# Altium project UNG_8077_EVB_LAN7801-KSZ9031.PrjPcb (part 2 of 2)

## Sheet UNG8077_EVB_7801-9031_A_4-KSZ9031.SchDoc
size 416 x 264 mm; DrawnBy: Carl Johnson; Engineer: Xuelu Li; Revision: A; SheetNumber: 4; SheetTotal: 5; PageTitle: KSZ9031RNX; PageSetup: Record=PageOptions|CenterHorizontal=True|CenterVertical=True|PrintScale=1.02|XCorrection=1.00|YCorrection=1.00|PrintKind=0|BorderSize=5000000|LeftOffset=0|BottomOffset=0|Orientation=2|PaperLength=1000|PaperWidth=1000|Scale=100|PaperSource=7|PrintQuality=-3|MediaType=1|DitherType=10|PrintScaleMode=1|PaperKind=11 x 17|PaperIndex=119; DesignDescription: EVB_LAN7801 to KSZ9031RNX; ProjName: EVB_LAN7801-KSZ9031; Designer: Xuelu Li; PartNumber: UNG_8077; DocumentFullPathAndName: //depot_np_hweng_boards/ung_hweng/UNG_8077_LAN7801-KSZ9031_DemoEVB/A/; ProjectName: UNG_8077_EVB_LAN7801-KSZ9031.PrjPcb
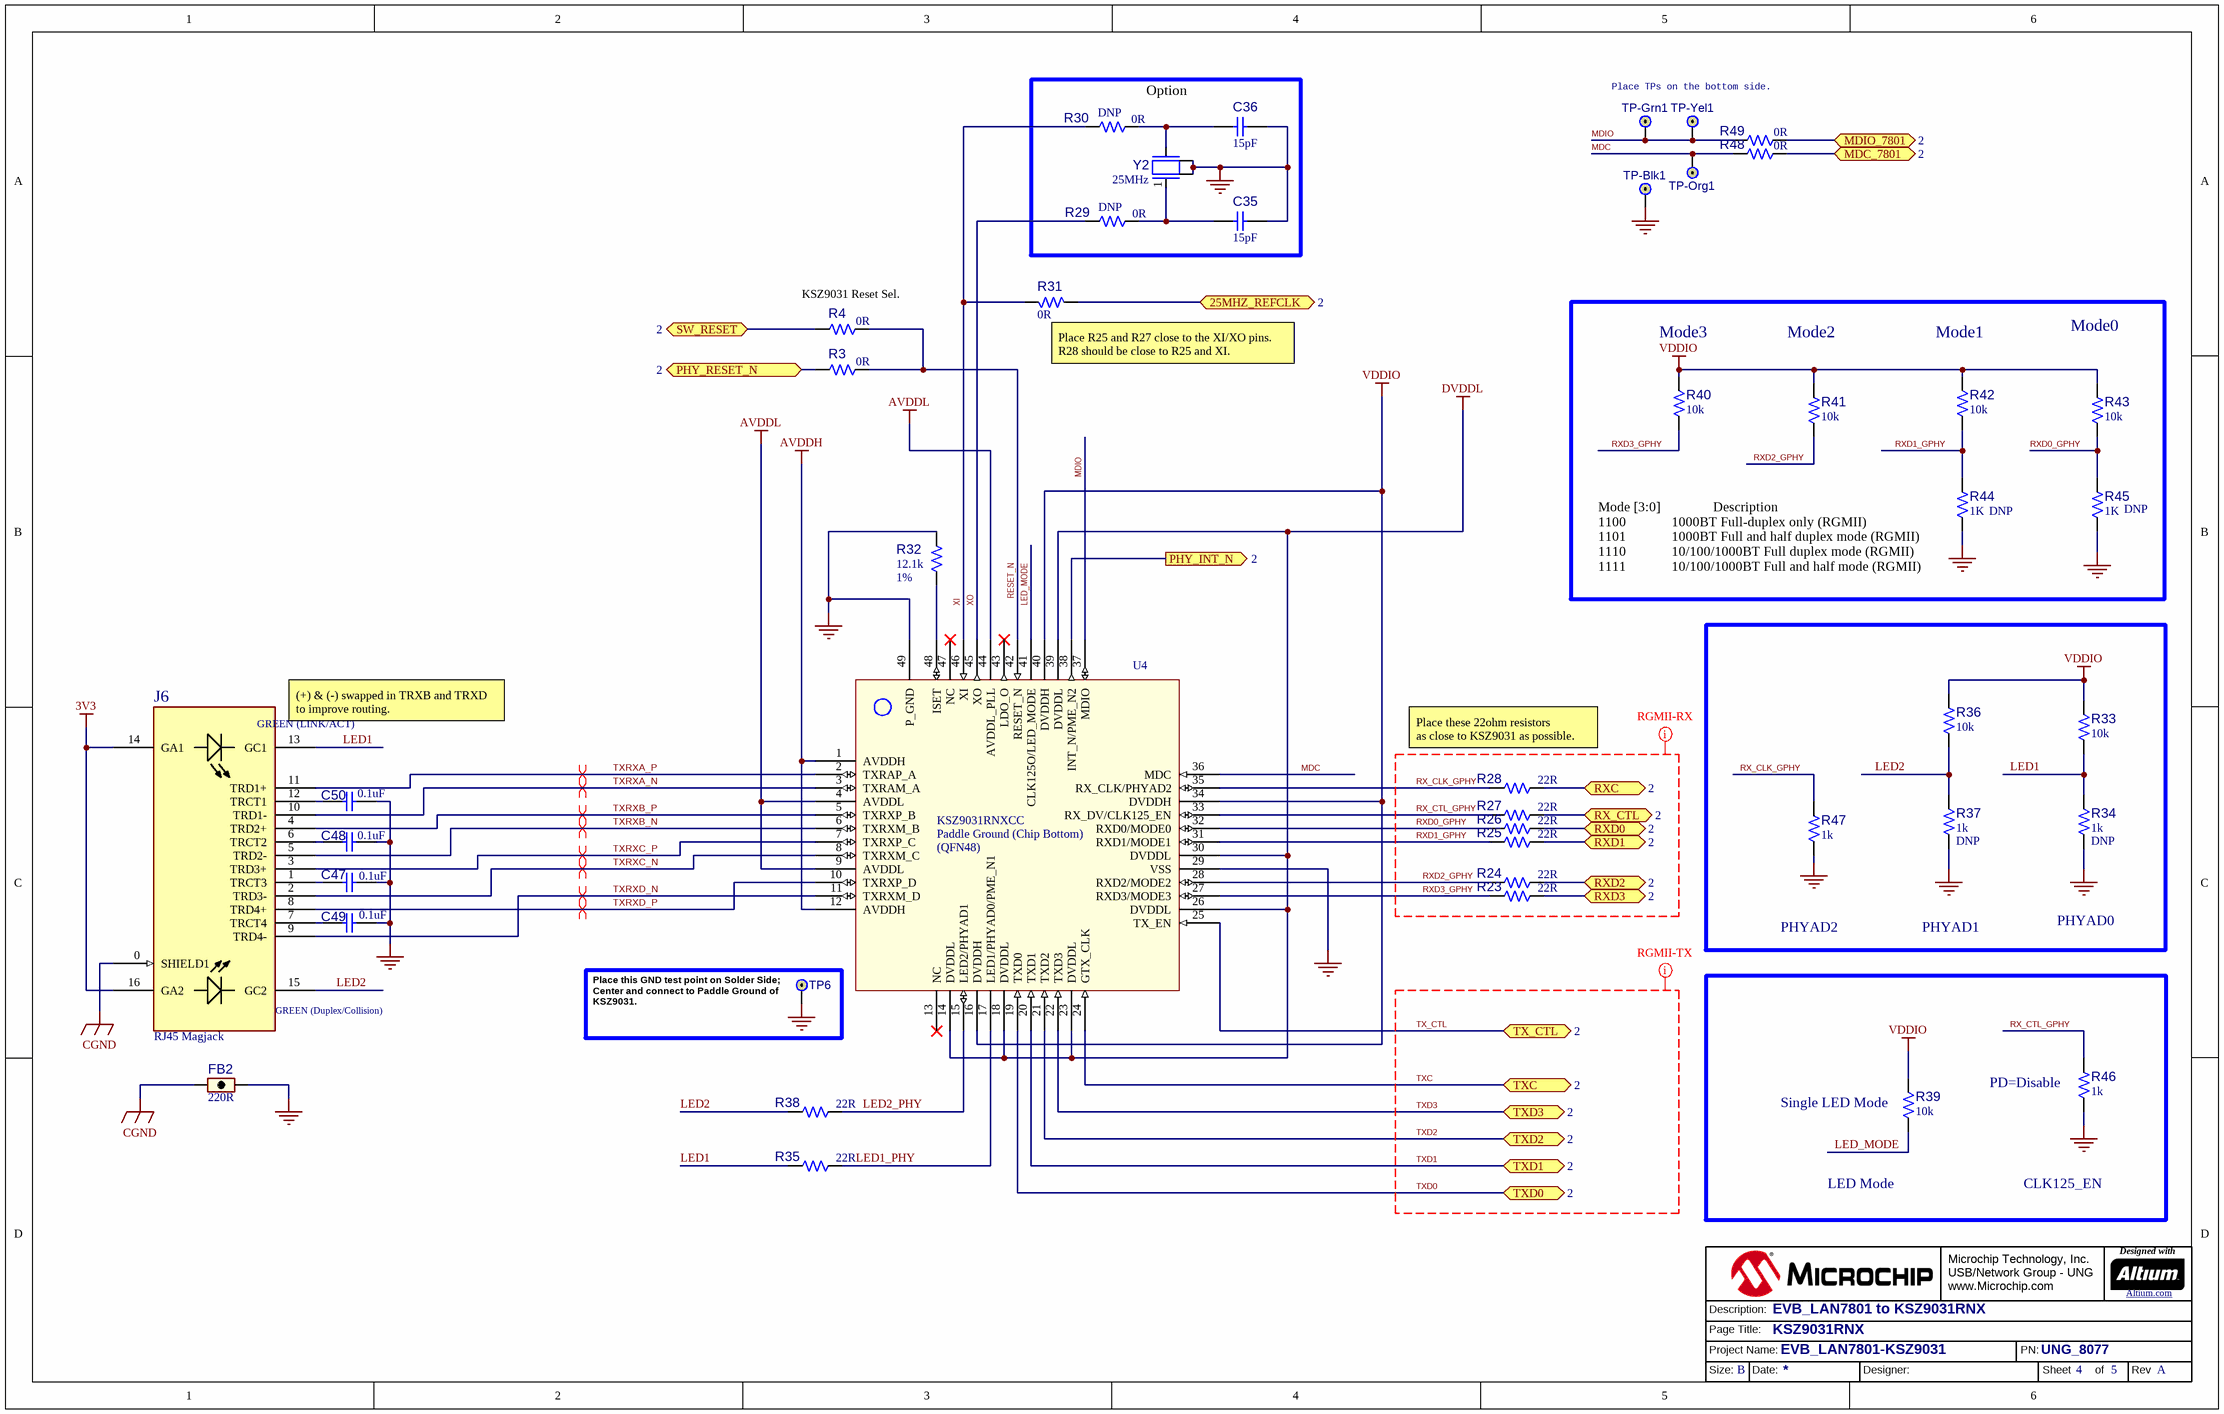
[diagram p3: UNG8077_EVB_7801-9031_A_4-KSZ9031.SchDoc]

### Parts
(Parts that share a designator on the sheet are numbered #1, #2 ... from top to bottom, then left to right.)
?#4  (no value)  (graphical)
C35  value 15pF  [CAP_C_0402]  (hidden comment: Capacitor NP)
C36  value 15pF  [CAP_C_0402]  (hidden comment: Capacitor NP)
C47  value 0.1uF  [CAP_C_0402]  (hidden comment: CAP CER 0.1UF 35V)
C48  value 0.1uF  [CAP_C_0402]  (hidden comment: CAP CER 0.1UF 35V)
C49  value 0.1uF  [CAP_C_0402]  (hidden comment: CAP CER 0.1UF 35V)
C50  value 0.1uF  [CAP_C_0402]  (hidden comment: CAP CER 0.1UF 35V)
FB2  value 220R  [IND_C_0603]  (hidden comment: Ferrite Bead)
J6  RJ45 Magjack  [CON_MODULAR_RJ45_TH_RA_RJMG2012211A0FR]
R3  value 0R  [RES_C_0603]  (hidden comment: Resistor)
R4  value 0R  [RES_C_0603]  (hidden comment: Resistor)
R23  value 22R  [RES_C_0402]  (hidden comment: Resistor)
R24  value 22R  [RES_C_0402]  (hidden comment: Resistor)
R25  value 22R  [RES_C_0402]  (hidden comment: Resistor)
R26  value 22R  [RES_C_0402]  (hidden comment: Resistor)
R27  value 22R  [RES_C_0402]  (hidden comment: Resistor)
R28  value 22R  [RES_C_0402]  (hidden comment: Resistor)
R29  value 0R  Populated: DNP  [RES_C_0603]  (hidden comment: Resistor)
R30  value 0R  Populated: DNP  [RES_C_0603]  (hidden comment: Resistor)
R31  value 0R  [RES_C_0603]  (hidden comment: Resistor)
R32  value 12.1k  Tolerance: 1%  [RES_C_0603]  (hidden comment: Resistor)
R33  value 10k  [RES_C_0603]  (hidden comment: Resistor)
R34  value 1k  Populated: DNP  [RES_C_0603]  (hidden comment: Resistor)
R35  value 22R  [RES_C_0402]  (hidden comment: Resistor)
R36  value 10k  [RES_C_0603]  (hidden comment: Resistor)
R37  value 1k  Populated: DNP  [RES_C_0603]  (hidden comment: Resistor)
R38  value 22R  [RES_C_0402]  (hidden comment: Resistor)
R39  value 10k  [RES_C_0603]  (hidden comment: Resistor)
R40  value 10k  [RES_C_0603]  (hidden comment: Resistor)
R41  value 10k  [RES_C_0603]  (hidden comment: Resistor)
R42  value 10k  [RES_C_0603]  (hidden comment: Resistor)
R43  value 10k  [RES_C_0603]  (hidden comment: Resistor)
R44  value 1K  Populated: DNP  [RES_C_0603]  (hidden comment: Resistor)
R45  value 1K  Populated: DNP  [RES_C_0603]  (hidden comment: Resistor)
R46  value 1k  [RES_C_0603]  (hidden comment: Resistor)
R47  value 1k  [RES_C_0603]  (hidden comment: Resistor)
R48  value 0R  [RES_C_0603]  (hidden comment: Resistor)
R49  value 0R  [RES_C_0603]  (hidden comment: Resistor)
TP6  Jumper  [TP_PAD_VIA_20-10]  (value not drawn)
TP-Blk1  Jumper  [TP_PAD51D36]  (value not drawn)  (no BOM)
TP-Grn1  Jumper  [TP_PAD51D36]  (value not drawn)  (no BOM)
TP-Org1  Jumper  [TP_PAD51D36]  (value not drawn)  (no BOM)
TP-Yel1  Jumper  [TP_PAD51D36]  (value not drawn)  (no BOM)
U4  (no value)  [QFN-48_7x7-EP5.1sq]
Y2  Frequency: 25MHz  [XTAL_4PIN_3M2X2M5]  (hidden comment: XTAL 25MHz 4 pins 3225)

### Blocks framed on the sheet
Option: C35 C36 R29 R30 Y2

### Ports
25MHZ_REFCLK (bidir, see 2), MDC_7801 (bidir, see 2), MDIO_7801 (bidir, see 2), PHY_INT_N (out, see 2), PHY_RESET_N (bidir, see 2), RX_CTL (bidir, see 2), RXC (bidir, see 2), RXD0 (bidir, see 2), RXD1 (bidir, see 2), RXD2 (bidir, see 2), RXD3 (bidir, see 2), SW_RESET (bidir, see 2), TX_CTL (bidir, see 2), TXC (bidir, see 2), TXD0 (bidir, see 2), TXD1 (bidir, see 2), TXD2 (bidir, see 2), TXD3 (bidir, see 2)

### Nets
3V3: J6.14(GA1) J6.16(GA2)
AVDDH: U4.1(AVDDH) U4.12(AVDDH)
AVDDL: U4.4(AVDDL) U4.9(AVDDL) U4.44(AVDDL_PLL)
CGND: FB2.1 J6.0(SHIELD1)
DVDDL: U4.14(DVDDL) U4.18(DVDDL) U4.23(DVDDL) U4.26(DVDDL) U4.30(DVDDL) U4.39(DVDDL)
GND: C35.2 C36.2 C47.2 C48.2 C49.2 C50.2 FB2.2 R32.2 R34.1 R37.1 R44.1 R45.1 R46.1 R47.1 TP6.1(P1) TP-Blk1.1(P1) U4.29(VSS) U4.49(P_GND) Y2.2(GND) Y2.4(GND)
VDDIO: R33.1 R36.1 R39.1 R40.1 R41.1 R42.1 R43.1 U4.16(DVDDH) U4.34(DVDDH) U4.40(DVDDH)
25MHZ_REFCLK: R31.1 ; port 25MHZ_REFCLK
LED1: J6.13(GC1) R33.2 R34.2 R35.1
LED1_PHY: R35.2 U4.17(LED1/PHYAD0/PME_N1)
LED2: J6.15(GC2) R36.2 R37.2 R38.1
LED2_PHY: R38.2 U4.15(LED2/PHYAD1)
LED_MODE: R39.2 U4.41(CLK125O/LED_MODE)
MDC: R48.1 TP-Org1.1(P1) U4.36(MDC)
MDC_7801: R48.2 ; port MDC_7801
MDIO: R49.1 TP-Grn1.1(P1) TP-Yel1.1(P1) U4.37(MDIO)
MDIO_7801: R49.2 ; port MDIO_7801
PHY_INT_N: U4.38(INT_N/PME_N2) ; port PHY_INT_N
PHY_RESET_N: R3.1 ; port PHY_RESET_N
RESET_N: R3.2 R4.2 U4.42(RESET_N)
RX_CLK_GPHY: R28.1 R47.2 U4.35(RX_CLK/PHYAD2)
RX_CTL: R27.2 ; port RX_CTL
RX_CTL_GPHY: R27.1 R46.2 U4.33(RX_DV/CLK125_EN)
RXC: R28.2 ; port RXC
RXD0: R26.2 ; port RXD0
RXD0_GPHY: R26.1 R43.2 R45.2 U4.32(RXD0/MODE0)
RXD1: R25.2 ; port RXD1
RXD1_GPHY: R25.1 R42.2 R44.2 U4.31(RXD1/MODE1)
RXD2: R24.2 ; port RXD2
RXD2_GPHY: R24.1 R41.2 U4.28(RXD2/MODE2)
RXD3: R23.2 ; port RXD3
RXD3_GPHY: R23.1 R40.2 U4.27(RXD3/MODE3)
SW_RESET: R4.1 ; port SW_RESET
TX_CTL: U4.25(TX_EN) ; port TX_CTL
TXC: U4.24(GTX_CLK) ; port TXC
TXD0: U4.19(TXD0) ; port TXD0
TXD1: U4.20(TXD1) ; port TXD1
TXD2: U4.21(TXD2) ; port TXD2
TXD3: U4.22(TXD3) ; port TXD3
TXRXA_N: J6.10(TRD1-) U4.3(TXRAM_A)
TXRXA_P: J6.11(TRD1+) U4.2(TXRAP_A)
TXRXB_N: J6.5(TRD2-) U4.6(TXRXM_B)
TXRXB_P: J6.4(TRD2+) U4.5(TXRXP_B)
TXRXC_N: J6.2(TRD3-) U4.8(TXRXM_C)
TXRXC_P: J6.3(TRD3+) U4.7(TXRXP_C)
TXRXD_N: J6.9(TRD4-) U4.11(TXRXM_D)
TXRXD_P: J6.8(TRD4+) U4.10(TXRXP_D)
XI: R30.1 R31.2 U4.46(XI)
XO: R29.1 U4.45(XO)
NetC35_1: C35.1 R29.2 Y2.1(Osc1)
NetC36_1: C36.1 R30.2 Y2.3(Osc2)
NetC47_1: C47.1 J6.1(TRCT3)
NetC48_1: C48.1 J6.6(TRCT2)
NetC49_1: C49.1 J6.7(TRCT4)
NetC50_1: C50.1 J6.12(TRCT1)
NetR32_1: R32.1 U4.48(ISET)

Not connected (* = marked no-connect by the designer): U4 13(NC)* 43(LDO_O)* 47(NC)*

### Layout directives
net class RGMII-RX: RX_CLK_GPHY, RX_CTL_GPHY, RXD0_GPHY, RXD1_GPHY, RXD2_GPHY, RXD3_GPHY
differential pair; net class GBE: TXRXA_N, TXRXA_P, TXRXB_N, TXRXB_P, TXRXC_N, TXRXC_P, TXRXD_N, TXRXD_P
net class RGMII-TX: TX_CTL, TXC, TXD0, TXD1, TXD2, TXD3

### Notes on the sheet
- Place TPs on the bottom side.
- (near R4) KSZ9031 Reset Sel.
- (near R31) Place R25 and R27 close to the XI/XO pins.
  R28 should be close to R25 and XI.
- (near R40) Mode3
- Mode2
- (near R42) Mode1
- Mode0
- (near R44) Mode [3:0]               Description
  1100             1000BT Full-duplex only (RGMII)
  1101             1000BT Full and half duplex mode (RGMII)
  1110             10/100/1000BT Full duplex mode (RGMII)
  1111             10/100/1000BT Full and half mode (RGMII)
- (near J6) (+) & (-) swapped in TRXB and TRXD to improve routing.
- (near R28) Place these 22ohm resistors
  as close to KSZ9031 as possible.
- PHYAD2
- PHYAD1
- PHYAD0
- (near TP6) Place this GND test point on Solder Side;
  Center and connect to Paddle Ground of KSZ9031.
- (near R46) PD=Disable
- (near R39) Single LED Mode
- LED Mode
- CLK125_EN
- Microchip Technology, Inc.
  USB/Network Group - UNG
  www.Microchip.com
- Designed with
- Altium.com <http://go.altium.com/MicrochipLandingPage_Evaluation.html>
- Page Title:
- Project Name:
- Description:
- PN:
- Size:
- B
- Date:
- Designer:
- Sheet
- of
- Rev
- (in symbol CON RJ-45 RJMG2012211A0FR) GREEN (LINK/ACT); GREEN (Duplex/Collision)
- (in symbol KSZ9031RNXCC) Paddle Ground (Chip Bottom); (QFN48)

### Library data of the parts
?#4 = Title Block B_UNG1_Altium
C35 C36 = CAP1413: Capacitor; Manufacturer 1: Johanson Technology Inc; Manufacturer Part Number 1: 500R07S150JV4T; Description_: CAP HiQ 15pF 50V 5% NP0 2.32GHz SMD 0402; Dev Tools Status: Design; Tolerance: 5%; Temperature Coeffcient: NP0; ESR: 0.033R; Type: HiQ; Owner: Gabor Bihari; Populated: YES; MCHP-ID: CAP1413; Revision: A; Status: MCL Design; ComponentLink1URL: https://chn-vm-apps.microchip.com/mchprepo/parts/Datasheets/http://www.johansontechnology.com/downloads/JTI-CAT-MLCC-HighQ.pdf; ComponentLink1Description: Datasheet; Operating Temperature: -55°C to 125°C; Category: Capacitor; Supplier 1: Digi-Key; Supplier Part Number 1: 712-1261-1-ND; Quantity Override: 1
C47-C50 = CAP1463: Capacitor; Manufacturer 1: TDK Corporation; Manufacturer Part Number 1: C1005X7R1H104K050BB; Tolerance: 10%; Description_: CAP CER 0.1uF 50V 10% X7R SMD 0402; Dev Tools Status: Design; Temperature Coeffcient: X7R; Type: Ceramic; Owner: Jamus Griego; Populated: YES; Revision: A; ComponentLink1URL: https://chn-vm-apps.microchip.com/mchprepo/parts/Datasheets/TDKMLCCCapRange.pdf; ComponentLink1Description: Datasheets; Operating Temperature: -55C to +125C; Category: Capacitor; Supplier 1: Digi-Key; Supplier Part Number 1: 445-5932-1-ND; MCHP-ID: CAP1463; Status: MCL Design; Quantity Override: 1
FB2 = IND1313: Manufacturer 1: Murata Electronics North America; Manufacturer Part Number 1: BLM18EG221SN1D; Description_: FERRITE 220R @ 100MHz 2A SMD 0603; Dev Tools Status: Design; Owner: Razvan Cristescu; Populated: YES; MCHP-ID: IND1313; Revision: A; Symbol: Ferrite Bead; Status: MCL Design; ComponentLink1Description: Datasheet; Package: 0603; Type: Ferrite Bead; Category: Inductor; Supplier 1: Digi-Key; Supplier Part Number 1: 490-3992-6-ND; Quantity Override: 1
J6 = CON RJ-45 RJMG2012211A0FR: Manufacturer 1: Amphenol Commercial Products; Populated: Yes; Description_: CON MODULAR RJ45 MAGJACK TH R/A; Manufacturer Part Number 1: RJMG2012211A0FR; RoHS: RoHS Compliant; ComponentLink1URL: https://www.amphenolcanada.com/ProductSearch/Drawings/AC/RJMG2012211A0FR.PDF; ComponentLink1Description: Datasheet; Supplier 1: Digikey; Supplier Part Number 1: RJMG2012211A0FR-ND; Value: RJ45 Magjack
R3 R4 R31 R48 R49 = RSMT0001: Manufacturer 1: NIC Components; Manufacturer Part Number 1: NRC06Z0TRF; Description_: RES TKF 0R 1/10W SMD 0603; Power: 1/10W; Populated: Yes; MCHP-ID: RSMT0001; Revision: 2; Status: Production; ComponentLink1URL: https://chn-vm-apps.microchip.com/mchprepo/parts/Datasheets/nrc.pdf; ComponentLink1Description: Datasheet; Operating Temperature: -55C to +155C; Category: Resistor; Type: RES SMD; Composition: TKF; Manufacturer 2: Panasonic; Manufacturer Part Number 2: ERJ-3GSY0R00V; Manufacturer 3: Panasonic; Manufacturer Part Number 3: ERJ-3GEY0R00V; Manufacturer 4: Stackpole Electronics Inc; Manufacturer Part Number 4: RMCF0603ZT0R00; Manufacturer 5: Vishay; Manufacturer Part Number 5: CRCW06030000Z0EA; Manufacturer 6: Stackpole Electronics Inc; Manufacturer Part Number 6: RMCF 1/16 0 R; Manufacturer 7: Yageo; Manufacturer Part Number 7: RC0603JR-070RL; Manufacturer 8: KOA Speer; Manufacturer Part Number 8: RK73Z1JTTP; Manufacturer 9: ROHM; Manufacturer Part Number 9: MCR03EZPJ000; Supplier 1: NIC Components; Supplier Part Number 1: NRC06Z0TRF; Supplier 2: Digi-Key; Supplier Part Number 2: P0.0GTR-ND; Supplier 3: Digi-Key; Supplier Part Number 3: RMCF0603ZT0R00TR-ND; Supplier 4: Digi-Key; Supplier Part Number 4: RMCF0603ZT0R00CT-ND; Supplier 5: Digi-Key; Supplier Part Number 5: 541-0.0GCT-ND; Supplier 6: Digi-Key; Supplier Part Number 6: RMCF1/160RTR-ND; Supplier 7: Digi-Key; Supplier Part Number 7: 311-0.0GRCT-ND; Supplier 8: KOA Speer; Supplier Part Number 8: RK73Z1JTTP; Supplier 9: Digi-Key; Supplier Part Number 9: RHM0.0GCT-ND; Quantity Override: 1
  R31: Package: 0603
R23-R28 R35 R38 = RES1474: Manufacturer 1: Panasonic Electronic Components; Manufacturer Part Number 1: ERJ-2RKF22R0X; Tolerance: 1%; Description_: RES TKF 22R 1% 1/20W SMD 0402; Dev Tools Status: Design; Temperature Coeffcient: 100ppm/C; Circuit Type: Isolated; Power: 1/10W; Owner: Mike Ragsdale; Populated: YES; MCHP-ID: RES1474; Package: 0402; Revision: 1; Symbol: Resistor; Status: MCL Design; Operating Temperature: -55C to +155C; Category: Resistor; Type: RES SMD; Composition: TKF; Supplier 1: Digi-Key; Supplier Part Number 1: P22.0LCT-ND; Quantity Override: 1
R29 R30 = RSMT0001: Manufacturer 1: NIC Components; Manufacturer Part Number 1: NRC06Z0TRF; Description_: RES TKF 0R 1/10W SMD 0603; Power: 1/10W; MCHP-ID: RSMT0001; Revision: 2; Status: Production; ComponentLink1URL: https://chn-vm-apps.microchip.com/mchprepo/parts/Datasheets/nrc.pdf; ComponentLink1Description: Datasheet; Operating Temperature: -55C to +155C; Category: Resistor; Type: RES SMD; Composition: TKF; Manufacturer 2: Panasonic; Manufacturer Part Number 2: ERJ-3GSY0R00V; Manufacturer 3: Panasonic; Manufacturer Part Number 3: ERJ-3GEY0R00V; Manufacturer 4: Stackpole Electronics Inc; Manufacturer Part Number 4: RMCF0603ZT0R00; Manufacturer 5: Vishay; Manufacturer Part Number 5: CRCW06030000Z0EA; Manufacturer 6: Stackpole Electronics Inc; Manufacturer Part Number 6: RMCF 1/16 0 R; Manufacturer 7: Yageo; Manufacturer Part Number 7: RC0603JR-070RL; Manufacturer 8: KOA Speer; Manufacturer Part Number 8: RK73Z1JTTP; Manufacturer 9: ROHM; Manufacturer Part Number 9: MCR03EZPJ000; Supplier 1: NIC Components; Supplier Part Number 1: NRC06Z0TRF; Supplier 2: Digi-Key; Supplier Part Number 2: P0.0GTR-ND; Supplier 3: Digi-Key; Supplier Part Number 3: RMCF0603ZT0R00TR-ND; Supplier 4: Digi-Key; Supplier Part Number 4: RMCF0603ZT0R00CT-ND; Supplier 5: Digi-Key; Supplier Part Number 5: 541-0.0GCT-ND; Supplier 6: Digi-Key; Supplier Part Number 6: RMCF1/160RTR-ND; Supplier 7: Digi-Key; Supplier Part Number 7: 311-0.0GRCT-ND; Supplier 8: KOA Speer; Supplier Part Number 8: RK73Z1JTTP; Supplier 9: Digi-Key; Supplier Part Number 9: RHM0.0GCT-ND; Quantity Override: 1
R32 = RSMT0414: Manufacturer 1: Panasonic; Manufacturer Part Number 1: ERJ-3EKF1212V; Description_: RES TKF 12.1k 1% 1/10W SMD 0603; Dev Tools Status: Production; Voltage: 75V; Temperature Coeffcient: 100ppm/C; Power: 1/10W; Populated: Yes; MCHP-ID: RSMT0414; Revision: 1; Status: MCL Design; ComponentLink1URL: https://chn-vm-apps.microchip.com/mchprepo/parts/Datasheets/AOA0000CE2.pdf; ComponentLink1Description: Datasheet; Operating Temperature: -55C to +155C; Category: Resistor; Type: RES SMD; Composition: TKF; Manufacturer 2: ROHM; Manufacturer Part Number 2: MCR03EZPFX1212; Manufacturer 3: SET; Manufacturer Part Number 3: RMCF1/1612.1K1%TR; Supplier 1: Digi-Key; Supplier Part Number 1: P12.1KHCT-ND; Supplier 2: Digi-Key; Supplier Part Number 2: RHM12.1KHCT-ND; Supplier 3: SET; Supplier Part Number 3: RMCF1/1612.1K1%TR; Quantity Override: 1
R33 R36 R39-R43 = RES0191: Manufacturer 1: Panasonic; Manufacturer Part Number 1: ERJ-3GEYJ103V; Description_: RES TKF 10k 5% 1/10W SMD 0603; Voltage: 75V; Temperature Coeffcient: 200ppm/C; Power: 1/10W; Populated: Yes; MCHP-ID: RES0191; Revision: 2; Status: Production; ComponentLink1URL: https://chn-vm-apps.microchip.com/mchprepo/parts/Datasheets/AOA0000CE1.pdf; ComponentLink1Description: Datasheet; Operating Temperature: -55C to +155C; Category: Resistor; Type: RES SMD; Composition: TKF; Manufacturer 2: NIC Components; Manufacturer Part Number 2: NRC06J103TRF; Manufacturer 3: Yageo; Manufacturer Part Number 3: RC0603JR-0710KL; Supplier 1: Digi-Key; Supplier Part Number 1: P10KGCT-ND; Supplier 2: Digi-Key; Supplier Part Number 2: P10KGTR-ND; Supplier 3: NIC Components; Supplier Part Number 3: NRC06J103TRF; Supplier 4: Digi-Key; Supplier Part Number 4: 311-10KGRTR-ND; Quantity Override: 1
R34 R37 = RSMT0138: Manufacturer 1: Panasonic; Manufacturer Part Number 1: ERJ-3EKF1001V; Tolerance: 1%; Description_: RES TKF 1k 1% 1/10W SMD 0603; Dev Tools Status: Production; Voltage: 75V; Temperature Coeffcient: 100ppm/C; Power: 1/10W; MCHP-ID: RSMT0138; Package: 0603; Revision: 2; Symbol: Resistor; Status: MCL Design; ComponentLink1URL: https://chn-vm-apps.microchip.com/mchprepo/parts/Datasheets/AOA0000CE2.pdf; ComponentLink1Description: Datasheet; Operating Temperature: -55C to +155C; Category: Resistor; Type: RES SMD; Composition: TKF; Manufacturer 2: Yageo; Manufacturer Part Number 2: RC0603FR-071KL; Manufacturer 3: ROHM; Manufacturer Part Number 3: MCR03EZPFX1001; Manufacturer 4: Stackpole Electronics Inc; Manufacturer Part Number 4: RMCF0603FT1K00; Manufacturer 5: Stackpole Electronics Inc; Manufacturer Part Number 5: RMCF 1/16 1K 1% R; Manufacturer 6: Vishay; Manufacturer Part Number 6: CRCW06031K00FKEA; Manufacturer 7: Stackpole Electronics Inc; Manufacturer Part Number 7: RMCF1/161.0K1%TR; Manufacturer 8: TE Connectivity; Manufacturer Part Number 8: 1622866-1; Supplier 1: Digi-Key; Supplier Part Number 1: P1.00KHCT-ND; Supplier 2: Digi-Key; Supplier Part Number 2: P1.00KHTR-ND; Supplier 3: Digi-Key; Supplier Part Number 3: 311-1.00KHRCT-ND; Supplier 4: Digi-Key; Supplier Part Number 4: RHM1.00KHCT-ND; Supplier 5: Digi-Key; Supplier Part Number 5: RMCF1/161KFRTR-ND; Supplier 6: Digi-Key; Supplier Part Number 6: RMCF0603FT1K00TR-ND; Supplier 7: Newark; Supplier Part Number 7: 52K8015; Supplier 8: Stackpole Electronics Inc; Supplier Part Number 8: RMCF1/161.0K1%TR; Supplier 9: Digi-Key; Supplier Part Number 9: A106049CT-ND; Quantity Override: 1
R44 R45 = RSMT0047: Manufacturer 1: Panasonic; Manufacturer Part Number 1: ERJ-3GEYJ102V; Tolerance: 5%; Description_: RES TKF 1k 5% 1/10W SMD 0603; Voltage: 75V; Temperature Coeffcient: 200ppm/C; Power: 1/10W; MCHP-ID: RSMT0047; Revision: 1; Status: Production; ComponentLink1URL: https://chn-vm-apps.microchip.com/mchprepo/parts/Datasheets/AOA0000CE1.pdf; ComponentLink1Description: Datasheet; Operating Temperature: -55C to +155C; Category: Resistor; Type: RES SMD; Composition: TKF; Manufacturer 2: KOA Speer; Manufacturer Part Number 2: RK73B1JTTD102J; Manufacturer 3: Panasonic; Manufacturer Part Number 3: ERJ-3GSYJ102V; Manufacturer 4: ROHM; Manufacturer Part Number 4: MCR03EZHJ1K; Manufacturer 5: ROHM; Manufacturer Part Number 5: MCR03FZHJ1001; Manufacturer 6: Stackpole Electronics Inc; Manufacturer Part Number 6: RMCF 1/16 1K 5% R; Manufacturer 7: Yageo; Manufacturer Part Number 7: RC0603JR-071KL; Supplier 1: Digi-Key; Supplier Part Number 1: P1.0KGCT-ND; Supplier 2: Digi-Key; Supplier Part Number 2: P1.0KGTR-ND; Supplier 3: KOA Speer; Supplier Part Number 3: RK73B1JTTD102J; Supplier 4: ROHM; Supplier Part Number 4: MCR03EZHJ1K; Supplier 5: ROHM; Supplier Part Number 5: MCR03FZHJ1001; Supplier 6: Stackpole Electronics Inc; Supplier Part Number 6: RMCF 1/16 1K 5% R; Supplier 7: Digi-Key; Supplier Part Number 7: 311-1.0KGRTR-ND; Quantity Override: 1
R46 R47 = RSMT0138: Manufacturer 1: Panasonic; Manufacturer Part Number 1: ERJ-3EKF1001V; Tolerance: 1%; Description_: RES TKF 1k 1% 1/10W SMD 0603; Dev Tools Status: Production; Voltage: 75V; Temperature Coeffcient: 100ppm/C; Power: 1/10W; Populated: Yes; MCHP-ID: RSMT0138; Package: 0603; Revision: 2; Symbol: Resistor; Status: MCL Design; ComponentLink1URL: https://chn-vm-apps.microchip.com/mchprepo/parts/Datasheets/AOA0000CE2.pdf; ComponentLink1Description: Datasheet; Operating Temperature: -55C to +155C; Category: Resistor; Type: RES SMD; Composition: TKF; Manufacturer 2: Yageo; Manufacturer Part Number 2: RC0603FR-071KL; Manufacturer 3: ROHM; Manufacturer Part Number 3: MCR03EZPFX1001; Manufacturer 4: Stackpole Electronics Inc; Manufacturer Part Number 4: RMCF0603FT1K00; Manufacturer 5: Stackpole Electronics Inc; Manufacturer Part Number 5: RMCF 1/16 1K 1% R; Manufacturer 6: Vishay; Manufacturer Part Number 6: CRCW06031K00FKEA; Manufacturer 7: Stackpole Electronics Inc; Manufacturer Part Number 7: RMCF1/161.0K1%TR; Manufacturer 8: TE Connectivity; Manufacturer Part Number 8: 1622866-1; Supplier 1: Digi-Key; Supplier Part Number 1: P1.00KHCT-ND; Supplier 2: Digi-Key; Supplier Part Number 2: P1.00KHTR-ND; Supplier 3: Digi-Key; Supplier Part Number 3: 311-1.00KHRCT-ND; Supplier 4: Digi-Key; Supplier Part Number 4: RHM1.00KHCT-ND; Supplier 5: Digi-Key; Supplier Part Number 5: RMCF1/161KFRTR-ND; Supplier 6: Digi-Key; Supplier Part Number 6: RMCF0603FT1K00TR-ND; Supplier 7: Newark; Supplier Part Number 7: 52K8015; Supplier 8: Stackpole Electronics Inc; Supplier Part Number 8: RMCF1/161.0K1%TR; Supplier 9: Digi-Key; Supplier Part Number 9: A106049CT-ND; Quantity Override: 1
TP6 = TEST PAD TH VIA 20X10: Manufacturer Part Number: none; Description_: TEST Pad, VIA sized, 20pad, 10 FHS; Manufacturer: none; Category: Non BOM Item; Type: Male; Mounting Type: Through Hole; Supplier 1: none; Supplier Part Number 1: none; DNP: DNP
TP-Blk1 TP-Grn1 TP-Org1 TP-Yel1 = TEST PAD TH 51X36: Manufacturer Part Number: none; Description_: TEST Pad, PIN sized, 51pad, 36 FHS; Populated: Yes; Manufacturer: none; Category: Non BOM Item; Type: Male; Mounting Type: Through Hole; Supplier 1: none; Supplier Part Number 1: none
U4 = KSZ9031RNXCC: KSZ9031RNXCC 10/100/100 GPHY with RGMII 48QFN; Manufacturer 1: Microchip; Part Footprint Checked: Carl Johnson; Description_: KSZ9031RNXCC Gigabit Ethernet PHY with RGMII; Populated: Yes; Owner: Jennifer Hancock; Package: 48QFN, 7x7, 5.1x5.1 EPAD; RoHS: Yes; Manufacturer Part Number 1: KSZ9031RNXCC; Supplier 1: Mouser; Supplier Part Number 1: 998-KSZ9031RNXCC; Part Checked: Jennifer Hancock; Part 3D Model Checked: *; Status: New
Y2 = XTAL 25MHz 4 pins 3225: Crystal 25MHz 4 pins 3225; Manufacturer 1: Abracon; Manufacturer Part Number 1: ABM8G-25.000MHZ-B4Y-T; Frequency Stability: ±30ppm; Load Capacitance: 10pF; Operating Mode: Fundamental; Populated: Yes; Description_: Crystal 25MHz 10pF SMD 4Pin DFN LCC; Revision: A; RoHS: RoHS Compliant; Category: Crystals and Oscillators; Packaging: Cut Tape (CT); Type: 25MHz Crystal; Frequency Tolerance: ±30ppm; Operating Temperature: -20°C ~ 70°C; Package / Case: 4-SMD, No Lead (DFN, LCC); Size / Dimension: 3.2 mm x 2.5mm; ComponentLink1URL: http://nyusperforce.smsc.com//depot_np_hweng_boards/altium_libraries/datasheets/Abracon/ABM8G-10572.pdf; ComponentLink1Description: Datasheet; Supplier 1: Mouser; Supplier Part Number 1: 815-ABM8G-25-B4Y-T

## Sheet UNG8077_EVB_7801-9031_A_5-Power.SchDoc
size 416 x 264 mm; DrawnBy: Carl Johnson; Engineer: Xuelu Li; Revision: A; SheetNumber: 5; SheetTotal: 5; PageTitle: Power; PageSetup: Record=PageOptions|CenterHorizontal=True|CenterVertical=True|PrintScale=0.64|XCorrection=1.00|YCorrection=1.00|PrintKind=0|BorderSize=5000000|LeftOffset=0|BottomOffset=0|Orientation=2|PaperLength=1000|PaperWidth=1000|Scale=100|PaperSource=7|PrintQuality=-3|MediaType=1|DitherType=10|PrintScaleMode=1|PaperKind=11 x 17|PaperIndex=119; DesignDescription: EVB_LAN7801 to KSZ9031RNX; ProjName: EVB_LAN7801-KSZ9031; Designer: Xuelu Li; PartNumber: UNG_8077; DocumentFullPathAndName: //depot_np_hweng_boards/ung_hweng/UNG_8077_LAN7801-KSZ9031_DemoEVB/A/; ProjectName: UNG_8077_EVB_LAN7801-KSZ9031.PrjPcb
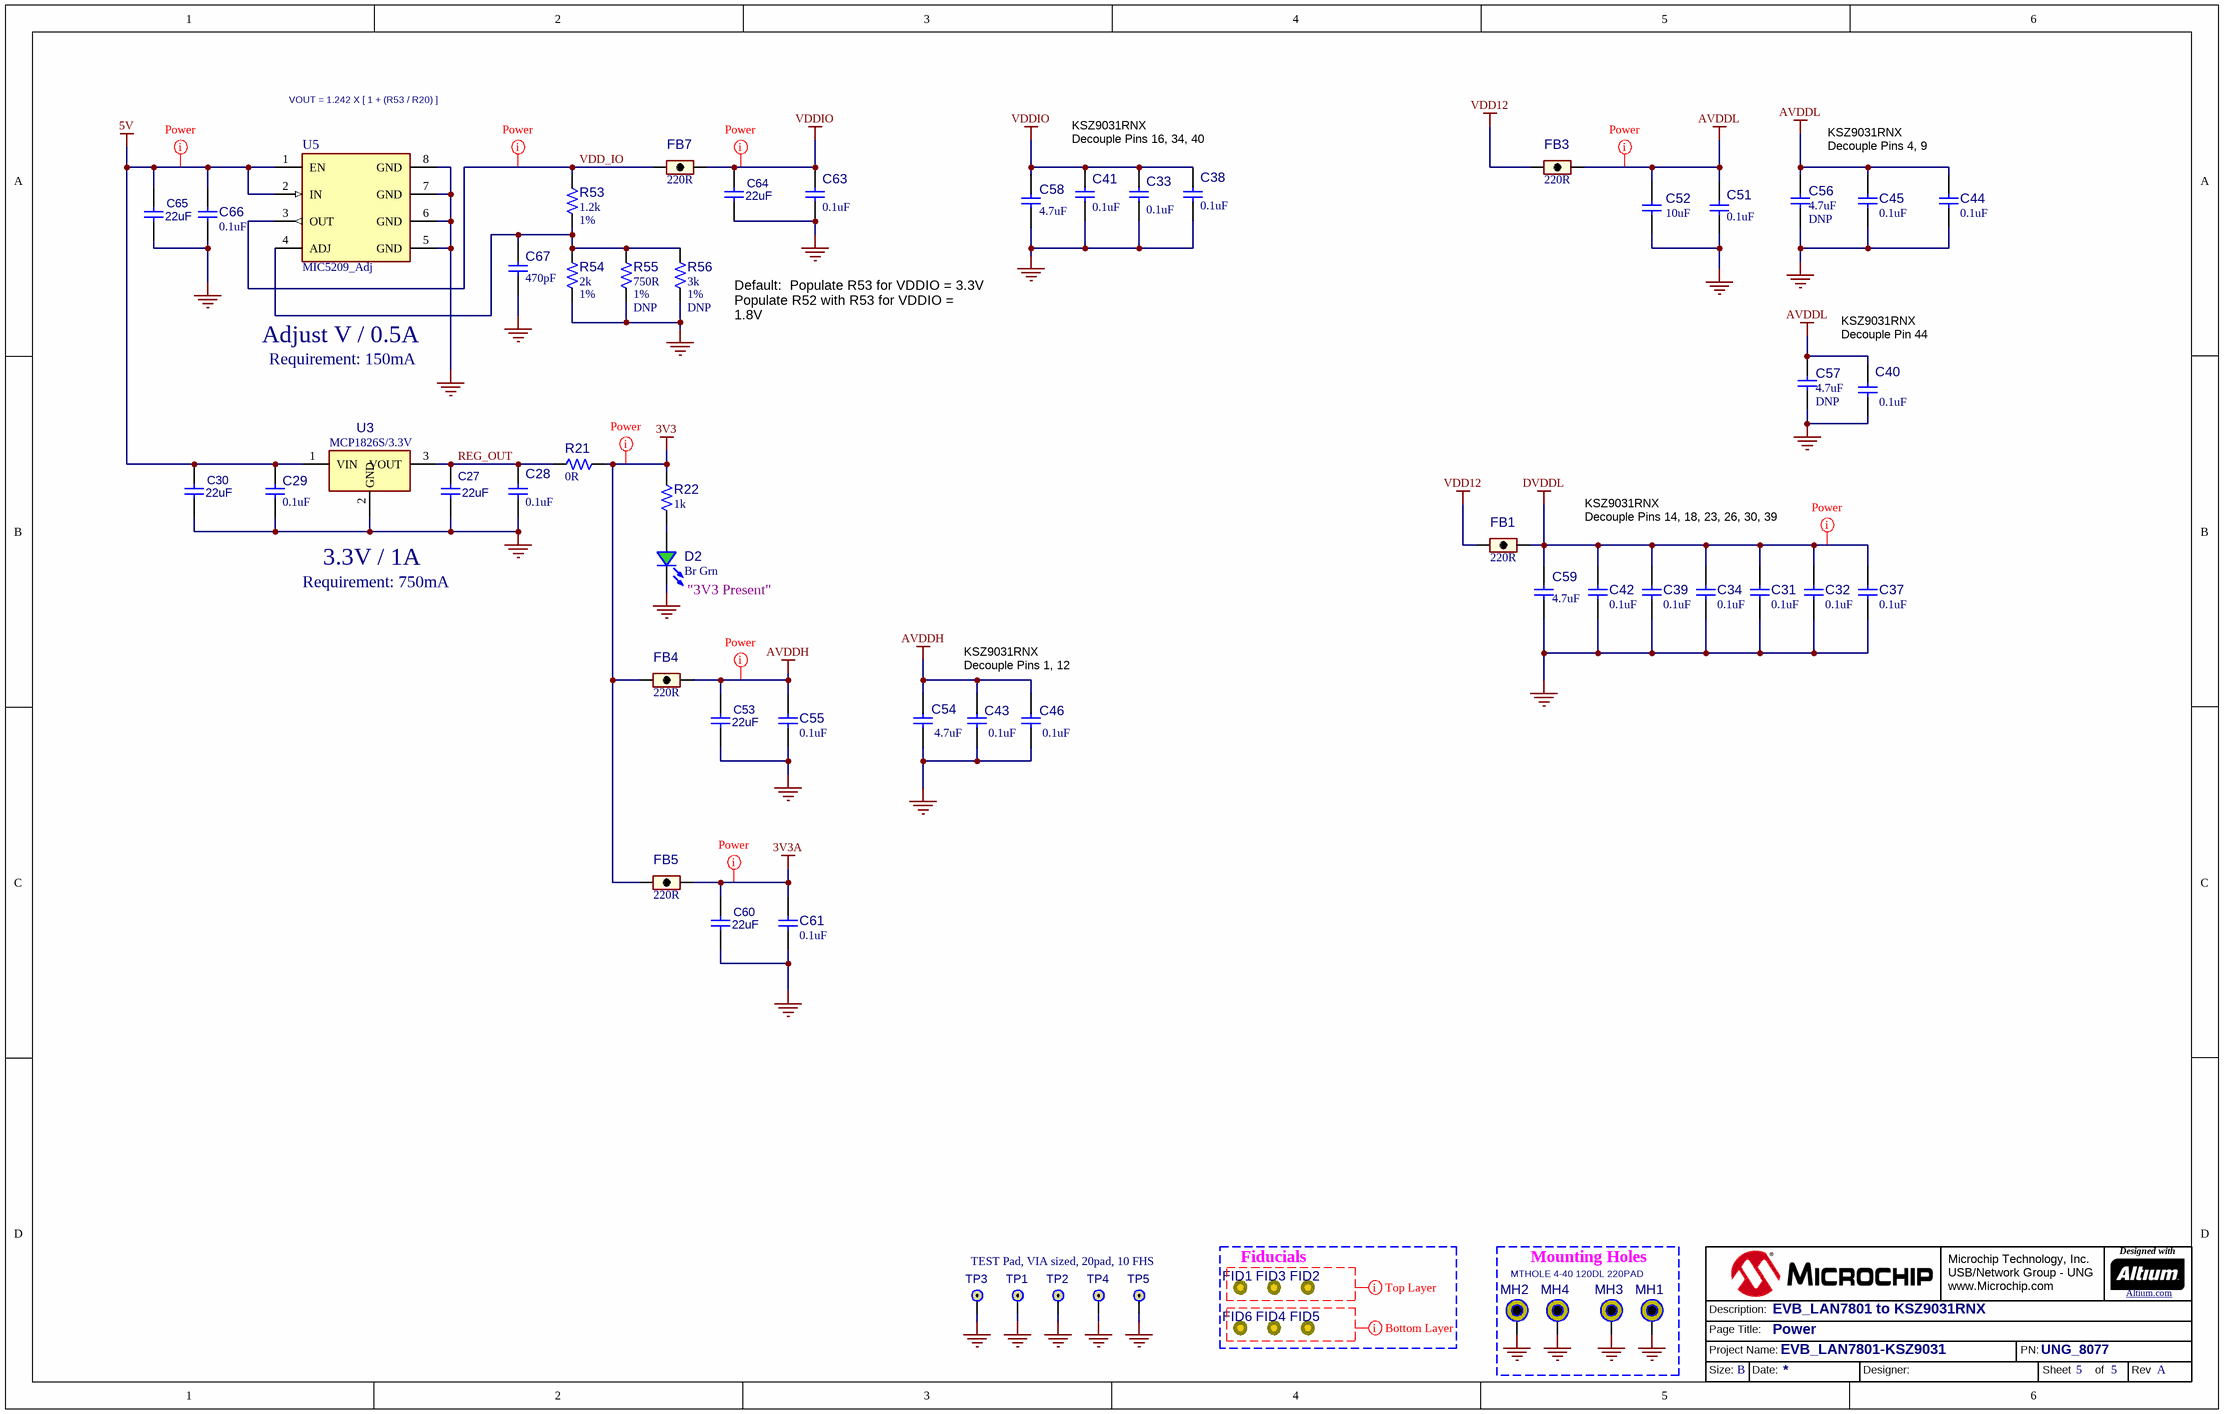
[diagram p4: UNG8077_EVB_7801-9031_A_5-Power.SchDoc]

### Parts
(Parts that share a designator on the sheet are numbered #1, #2 ... from top to bottom, then left to right.)
?#5  (no value)  (graphical)
C27  22uF  [CAP_C_0805]
C28  value 0.1uF  [CAP_C_0402]  (hidden comment: CAP CER 0.1UF 35V)
C29  value 0.1uF  [CAP_C_0402]  (hidden comment: CAP CER 0.1UF 35V)
C30  22uF  [CAP_C_0805]
C31  value 0.1uF  [CAP_C_0402]  (hidden comment: CAP CER 0.1UF 35V)
C32  value 0.1uF  [CAP_C_0402]  (hidden comment: CAP CER 0.1UF 35V)
C33  value 0.1uF  [CAP_C_0402]  (hidden comment: CAP CER 0.1UF 35V)
C34  value 0.1uF  [CAP_C_0402]  (hidden comment: CAP CER 0.1UF 35V)
C37  value 0.1uF  [CAP_C_0402]  (hidden comment: CAP CER 0.1UF 35V)
C38  value 0.1uF  [CAP_C_0402]  (hidden comment: CAP CER 0.1UF 35V)
C39  value 0.1uF  [CAP_C_0402]  (hidden comment: CAP CER 0.1UF 35V)
C40  value 0.1uF  [CAP_C_0402]  (hidden comment: CAP CER 0.1UF 35V)
C41  value 0.1uF  [CAP_C_0402]  (hidden comment: CAP CER 0.1UF 35V)
C42  value 0.1uF  [CAP_C_0402]  (hidden comment: CAP CER 0.1UF 35V)
C43  value 0.1uF  [CAP_C_0402]  (hidden comment: CAP CER 0.1UF 35V)
C44  value 0.1uF  [CAP_C_0402]  (hidden comment: CAP CER 0.1UF 35V)
C45  value 0.1uF  [CAP_C_0402]  (hidden comment: CAP CER 0.1UF 35V)
C46  value 0.1uF  [CAP_C_0402]  (hidden comment: CAP CER 0.1UF 35V)
C51  value 0.1uF  [CAP_C_0402]  (hidden comment: CAP CER 0.1UF 35V)
C52  value 10uF  [CAP_C_0603]  (hidden comment: Capacitor NP)
C53  22uF  [CAP_C_0805]
C54  value 4.7uF  [CAP_C_0603]  (hidden comment: Capacitor NP)
C55  value 0.1uF  [CAP_C_0402]  (hidden comment: CAP CER 0.1UF 35V)
C56  value 4.7uF  Populated: DNP  [CAP_C_0603]  (hidden comment: Capacitor NP)
C57  value 4.7uF  Populated: DNP  [CAP_C_0603]  (hidden comment: Capacitor NP)
C58  value 4.7uF  [CAP_C_0603]  (hidden comment: Capacitor NP)
C59  value 4.7uF  [CAP_C_0603]  (hidden comment: Capacitor NP)
C60  22uF  [CAP_C_0805]
C61  value 0.1uF  [CAP_C_0402]  (hidden comment: CAP CER 0.1UF 35V)
C63  value 0.1uF  [CAP_C_0402]  (hidden comment: CAP CER 0.1UF 35V)
C64  22uF  [CAP_C_0805]
C65  22uF  [CAP_C_0805]
C66  value 0.1uF  [CAP_C_0402]  (hidden comment: CAP CER 0.1UF 35V)
C67  value 470pF  [CAP_C_0402]  (hidden comment: Capacitor NP)
D2  value Br Grn  [LED_0603_GREEN]  (hidden comment: LED)
FB1  value 220R  [IND_C_0603]  (hidden comment: Ferrite Bead)
FB3  value 220R  [IND_C_0603]  (hidden comment: Ferrite Bead)
FB4  value 220R  [IND_C_0603]  (hidden comment: Ferrite Bead)
FB5  value 220R  [IND_C_0603]  (hidden comment: Ferrite Bead)
FB7  value 220R  [IND_C_0603]  (hidden comment: Ferrite Bead)
FID1  FIDUCIAL  [FIDUCIAL]  (value not drawn)  (no BOM)
FID2  FIDUCIAL  [FIDUCIAL]  (value not drawn)  (no BOM)
FID3  FIDUCIAL  [FIDUCIAL]  (value not drawn)  (no BOM)
FID4  FIDUCIAL  [FIDUCIAL]  (value not drawn)  (no BOM)
FID5  FIDUCIAL  [FIDUCIAL]  (value not drawn)  (no BOM)
FID6  FIDUCIAL  [FIDUCIAL]  (value not drawn)  (no BOM)
MH1  MTHOLE 4-40 120DL 220PAD  [MTHOLE_4-40]  (value not drawn)  (no BOM)
MH2  MTHOLE 4-40 120DL 220PAD  [MTHOLE_4-40]  (no BOM)
MH3  MTHOLE 4-40 120DL 220PAD  [MTHOLE_4-40]  (value not drawn)  (no BOM)
MH4  MTHOLE 4-40 120DL 220PAD  [MTHOLE_4-40]  (value not drawn)  (no BOM)
R21  value 0R  [RES_C_0603]  (hidden comment: Resistor)
R22  value 1k  [RES_C_0603]  (hidden comment: Resistor)
R53  value 1.2k  Tolerance: 1%  [RES_C_0603]  (hidden comment: Resistor)
R54  value 2k  Tolerance: 1%  [RES_C_0603]  (hidden comment: Resistor)
R55  value 750R  Tolerance: 1%  Populated: DNP  [RES_C_0603]  (hidden comment: Resistor)
R56  value 3k  Tolerance: 1%  Populated: DNP  [RES_C_0603]  (hidden comment: Resistor)
TP1  Jumper  [TP_PAD_VIA_20-10]  (value not drawn)
TP2  Jumper  [TP_PAD_VIA_20-10]  (value not drawn)
TP3  Jumper  [TP_PAD_VIA_20-10]  (value not drawn)
TP4  Jumper  [TP_PAD_VIA_20-10]  (value not drawn)
TP5  Description_: TEST Pad, VIA sized, 20pad, 10 FHS  [TP_PAD_VIA_20-10]  (hidden comment: Jumper)
U3  value MCP1826S/3.3V  [SOT-223-3]  (hidden comment: MCP182XS SOT-223-3_DDPAK-3_TO-220-3)
U5  value MIC5209_Adj  [SOIC-8]  (hidden comment: MIC5209 ADJ SOIC-8)

### Blocks framed on the sheet
Fiducials: FID1-FID6
Mounting Holes: MH1-MH4

### Nets
3V3: FB4.1 FB5.1 R21.2 R22.1
3V3A: C60.2 C61.2 FB5.2
5V: C29.2 C30.2 C65.2 C66.2 U3.1(VIN) U5.1(EN) U5.2(IN)
AVDDH: C43.2 C46.2 C53.2 C54.2 C55.2 FB4.2
AVDDL: C40.2 C44.2 C45.2 C51.2 C52.2 C56.2 C57.2 FB3.2
DVDDL: C31.2 C32.2 C34.2 C37.2 C39.2 C42.2 C59.2 FB1.2
GND: C27.1 C28.1 C29.1 C30.1 C31.1 C32.1 C33.1 C34.1 C37.1 C38.1 C39.1 C40.1 C41.1 C42.1 C43.1 C44.1 C45.1 C46.1 C51.1 C52.1 C53.1 C54.1 C55.1 C56.1 C57.1 C58.1 C59.1 C60.1 C61.1 C63.1 C64.1 C65.1 C66.1 C67.1 D2.2(K) MH1.1 MH2.1 MH3.1 MH4.1 R54.1 R55.1 R56.1 TP1.1(P1) TP2.1(P1) TP3.1(P1) TP4.1(P1) TP5.1(P1) U3.2(GND) U5.5(GND) U5.6(GND) U5.7(GND) U5.8(GND)
VDD12: FB1.1 FB3.1
VDDIO: C33.2 C38.2 C41.2 C58.2 C63.2 C64.2 FB7.2
REG_OUT: C27.2 C28.2 R21.1 U3.3(VOUT)
VDD_IO: FB7.1 R53.2 U5.3(OUT)
NetC67_2: C67.2 R53.1 R54.2 R55.2 R56.2 U5.4(ADJ)
NetD2_1: D2.1(A) R22.2

### Layout directives
net class Power (VBUS): 3V3, 3V3A, 5V, AVDDH, AVDDL, DVDDL, VDD_IO, VDDIO
rule Permitted Layers Rule [Permitted Layers - Top,]: (no net found under the mark)
rule Permitted Layers Rule [Permitted Layers - Bottom]: (no net found under the mark)

### Notes on the sheet
- VOUT = 1.242 X [ 1 + (R53 / R20) ]
- KSZ9031RNX
  Decouple Pins 16, 34, 40
- KSZ9031RNX
  Decouple Pins 4, 9
- Adjust V / 0.5A
- Default:  Populate R53 for VDDIO = 3.3V
  Populate R52 with R53 for VDDIO = 1.8V
  Populate R51 with R53 for VDDIO = 2.5V
- KSZ9031RNX
  Decouple Pin 44
- Requirement: 150mA
- KSZ9031RNX
  Decouple Pins 14, 18, 23, 26, 30, 39
- Requirement: 750mA
- 3.3V / 1A
- (near D2) "3V3 Present"
- KSZ9031RNX
  Decouple Pins 1, 12
- Microchip Technology, Inc.
  USB/Network Group - UNG
  www.Microchip.com
- Designed with
- Altium.com <http://go.altium.com/MicrochipLandingPage_Evaluation.html>
- Page Title:
- Project Name:
- Description:
- PN:
- Size:
- B
- Date:
- Designer:
- Sheet
- of
- Rev

### Library data of the parts
?#5 = Title Block B_UNG1_Altium
C27 C30 C53 C60 C64 C65 = CAP CER 22uF 10V 20% X5R SMD 0805: Manufacturer Part Number 1: C2012X5R1A226M125AB; Manufacturer 1: TDK; Owner: Jennifer Hancock; Description_: Capacitor, 22uF, 10V, 20%, X5R, 0805; Populated: Yes; Supplier Part Number 1: 810-C2012X5R1A226M-3; Supplier 1: Mouser; Revision Date: 04/27/2016; Supplier 2: Digi-Key; Supplier Part Number 2: 445-7665-6-ND; Tolerance: 20%; Rating: 10V; Document Link: http://nyusperforce.smsc.com//depot_np_hweng_boards/altium_libraries/datasheets/TDK\TDK_CSeries_Caps.pdf; RoHS: Yes; Value: 22uF
C28 C29 C31-C34 C37-C46 C51 C55 C61 C63 C66 = CAP1463: as C47 on sheet UNG8077_EVB_7801-9031_A_4-KSZ9031; Revision: A; ComponentLink1URL: https://chn-vm-apps.microchip.com/mchprepo/parts/Datasheets/TDKMLCCCapRange.pdf; ComponentLink1Description: Datasheets; Operating Temperature: -55C to +125C; Category: Capacitor; Supplier 1: Digi-Key; Supplier Part Number 1: 445-5932-1-ND; MCHP-ID: CAP1463; Status: MCL Design; Quantity Override: 1
C52 = CAP0533: Capacitor; Manufacturer 1: AVX; Manufacturer Part Number 1: 06036D106MAT2A; Description_: CAP CER 10uF 6.3V 20% X5R SMD 0603; Dev Tools Status: Production; Tolerance: 20%; Temperature Coeffcient: X5R; Type: Ceramic; Populated: Yes; MCHP-ID: CAP0533; Revision: 1; Status: MCL Design; ComponentLink1URL: https://chn-vm-apps.microchip.com/mchprepo/parts/Datasheets/smccp.pdf; ComponentLink1Description: Datasheet; Operating Temperature: -55C to +85C; Category: Capacitor; Manufacturer 2: KEMET; Manufacturer Part Number 2: C0603C106M9PACTU; Manufacturer 3: Murata; Manufacturer Part Number 3: GRM188R60J106ME47D; Manufacturer 4: TDK Corporation; Manufacturer Part Number 4: C1608X5R0J106M080AB; Manufacturer 5: TDK Corporation; Manufacturer Part Number 5: C1608X5R0J106M; Supplier 1: Digi-Key; Supplier Part Number 1: 478-5318-2-ND; Supplier 2: Digi-Key; Supplier Part Number 2: 399-5504-1-ND; Supplier 3: Digi-Key; Supplier Part Number 3: 490-3896-2-ND; Supplier 4: Digi-Key; Supplier Part Number 4: 445-4112-1-ND; Quantity Override: 1
C54 C58 C59 = CAP0397: Capacitor; Manufacturer 1: Panasonic; Manufacturer Part Number 1: ECJ-1VB0J475M; Description_: CAP CER 4.7uF 6.3V 20% X5R SMD 0603; Tolerance: 20%; Temperature Coeffcient: X5R; Type: Ceramic; Populated: Yes; MCHP-ID: CAP0397; Revision: 1; Status: Production; ComponentLink1URL: https://chn-vm-apps.microchip.com/mchprepo/parts/Datasheets/ECJ__General_.pdf; ComponentLink1Description: Datasheet; Operating Temperature: -55C to +85C; Category: Capacitor; Manufacturer 2: Murata; Manufacturer Part Number 2: GRM188R60J475ME19D; Supplier 1: Digi-Key; Supplier Part Number 1: PCC2318CT-ND; Supplier 2: Digi-Key; Supplier Part Number 2: 490-5421-1-ND; Quantity Override: 1
C56 C57 = CAP0397: Capacitor; Manufacturer 1: Panasonic; Manufacturer Part Number 1: ECJ-1VB0J475M; Description_: CAP CER 4.7uF 6.3V 20% X5R SMD 0603; Tolerance: 20%; Temperature Coeffcient: X5R; Type: Ceramic; MCHP-ID: CAP0397; Revision: 1; Status: Production; ComponentLink1URL: https://chn-vm-apps.microchip.com/mchprepo/parts/Datasheets/ECJ__General_.pdf; ComponentLink1Description: Datasheet; Operating Temperature: -55C to +85C; Category: Capacitor; Manufacturer 2: Murata; Manufacturer Part Number 2: GRM188R60J475ME19D; Supplier 1: Digi-Key; Supplier Part Number 1: PCC2318CT-ND; Supplier 2: Digi-Key; Supplier Part Number 2: 490-5421-1-ND; Quantity Override: 1
C67 = CAP1382: Capacitor; Manufacturer 1: Murata; Manufacturer Part Number 1: GRM1555C1H471JA01D; Description_: CAP CER 470pF 50V 5% NP0 SMD 0402; Dev Tools Status: Production; Tolerance: 5%; Temperature Coeffcient: NP0; Type: Ceramic; Owner: Duane Burt; Populated: YES; MCHP-ID: CAP1382; Revision: 1; Status: MCL Design; ComponentLink1URL: https://chn-vm-apps.microchip.com/mchprepo/parts/Datasheets/c02e.pdf; ComponentLink1Description: Datasheet; Operating Temperature: -55C to +125C; Category: Capacitor; Supplier 1: Digikey; Supplier Part Number 1: 490-1297-1-ND; Quantity Override: 1
D2 = LED, Bright Green, 0603: Manufacturer 1: Lite-On; Manufacturer Part Number 1: LTST-C191KGKT; Type: LED Single; Forward Current: 20mA; MCD: 35mcd; Owner: Jennifer Hancock; DNP: No; Viewing Angle: 130°; Revision: -; Description_: LED, Bright Green, 0603; Package: 0603 (1608 Metric); ComponentLink1URL: http://optoelectronics.liteon.com/upload/download/DS22-2000-228/S_110_LTST-C191KGKT.pdf; ComponentLink1Description: Datasheet; Category: Diode; Supplier 1: Digi-Key; Supplier Part Number 1: 160-1446-6-ND; Mounting Type: Surface Mount
FB1 FB3-FB5 FB7 = IND1313: as FB2 on sheet UNG8077_EVB_7801-9031_A_4-KSZ9031; MCHP-ID: IND1313; Revision: A; Symbol: Ferrite Bead; Status: MCL Design; ComponentLink1Description: Datasheet; Package: 0603; Type: Ferrite Bead; Category: Inductor; Supplier 1: Digi-Key; Supplier Part Number 1: 490-3992-6-ND; Quantity Override: 1
R21 = RSMT0001: as R3 on sheet UNG8077_EVB_7801-9031_A_4-KSZ9031; MCHP-ID: RSMT0001; Package: 0603; Revision: 2; Status: Production; ComponentLink1URL: https://chn-vm-apps.microchip.com/mchprepo/parts/Datasheets/nrc.pdf; ComponentLink1Description: Datasheet; Operating Temperature: -55C to +155C; Category: Resistor; Type: RES SMD; Composition: TKF; Manufacturer 2: Panasonic; Manufacturer Part Number 2: ERJ-3GSY0R00V; Manufacturer 3: Panasonic; Manufacturer Part Number 3: ERJ-3GEY0R00V; Manufacturer 4: Stackpole Electronics Inc; Manufacturer Part Number 4: RMCF0603ZT0R00; Manufacturer 5: Vishay; Manufacturer Part Number 5: CRCW06030000Z0EA; Manufacturer 6: Stackpole Electronics Inc; Manufacturer Part Number 6: RMCF 1/16 0 R; Manufacturer 7: Yageo; Manufacturer Part Number 7: RC0603JR-070RL; Manufacturer 8: KOA Speer; Manufacturer Part Number 8: RK73Z1JTTP; Manufacturer 9: ROHM; Manufacturer Part Number 9: MCR03EZPJ000; Supplier 1: NIC Components; Supplier Part Number 1: NRC06Z0TRF; Supplier 2: Digi-Key; Supplier Part Number 2: P0.0GTR-ND; Supplier 3: Digi-Key; Supplier Part Number 3: RMCF0603ZT0R00TR-ND; Supplier 4: Digi-Key; Supplier Part Number 4: RMCF0603ZT0R00CT-ND; Supplier 5: Digi-Key; Supplier Part Number 5: 541-0.0GCT-ND; Supplier 6: Digi-Key; Supplier Part Number 6: RMCF1/160RTR-ND; Supplier 7: Digi-Key; Supplier Part Number 7: 311-0.0GRCT-ND; Supplier 8: KOA Speer; Supplier Part Number 8: RK73Z1JTTP; Supplier 9: Digi-Key; Supplier Part Number 9: RHM0.0GCT-ND; Quantity Override: 1
R22 = RSMT0138: as R46 on sheet UNG8077_EVB_7801-9031_A_4-KSZ9031; MCHP-ID: RSMT0138; Package: 0603; Revision: 2; Symbol: Resistor; Status: MCL Design; ComponentLink1URL: https://chn-vm-apps.microchip.com/mchprepo/parts/Datasheets/AOA0000CE2.pdf; ComponentLink1Description: Datasheet; Operating Temperature: -55C to +155C; Category: Resistor; Type: RES SMD; Composition: TKF; Manufacturer 2: Yageo; Manufacturer Part Number 2: RC0603FR-071KL; Manufacturer 3: ROHM; Manufacturer Part Number 3: MCR03EZPFX1001; Manufacturer 4: Stackpole Electronics Inc; Manufacturer Part Number 4: RMCF0603FT1K00; Manufacturer 5: Stackpole Electronics Inc; Manufacturer Part Number 5: RMCF 1/16 1K 1% R; Manufacturer 6: Vishay; Manufacturer Part Number 6: CRCW06031K00FKEA; Manufacturer 7: Stackpole Electronics Inc; Manufacturer Part Number 7: RMCF1/161.0K1%TR; Manufacturer 8: TE Connectivity; Manufacturer Part Number 8: 1622866-1; Supplier 1: Digi-Key; Supplier Part Number 1: P1.00KHCT-ND; Supplier 2: Digi-Key; Supplier Part Number 2: P1.00KHTR-ND; Supplier 3: Digi-Key; Supplier Part Number 3: 311-1.00KHRCT-ND; Supplier 4: Digi-Key; Supplier Part Number 4: RHM1.00KHCT-ND; Supplier 5: Digi-Key; Supplier Part Number 5: RMCF1/161KFRTR-ND; Supplier 6: Digi-Key; Supplier Part Number 6: RMCF0603FT1K00TR-ND; Supplier 7: Newark; Supplier Part Number 7: 52K8015; Supplier 8: Stackpole Electronics Inc; Supplier Part Number 8: RMCF1/161.0K1%TR; Supplier 9: Digi-Key; Supplier Part Number 9: A106049CT-ND; Quantity Override: 1
R53 = RSMT1022: Manufacturer 1: Stackpole Electronics Inc; Manufacturer Part Number 1: RMCF0603FT1K20; Description_: RES TKF 1.2k 1% 1/10W SMD 0603; Dev Tools Status: Production; Voltage: 50V; Temperature Coeffcient: 100ppm/C; Current: 1A; Power: 1/10W; Owner: Aaron VanDuerm; Populated: Yes; MCHP-ID: RSMT1022; Revision: 1; Status: MCL Design; ComponentLink1URL: https://chn-vm-apps.microchip.com/mchprepo/parts/Datasheets/SEI-RMCF_RMCP.pdf; ComponentLink1Description: Datasheet; Operating Temperature: -55C to +155C; Category: Resistor; Type: RES SMD; Composition: TKF; Supplier 1: Digi-Key; Supplier Part Number 1: RMCF0603FT1K20CT-ND; Quantity Override: 1
R54 = RSMT0382: Manufacturer 1: Panasonic; Manufacturer Part Number 1: ERJ-3EKF2001V; Description_: RES TKF 2k 1% 1/10W SMD 0603; Voltage: 75V; Temperature Coeffcient: 100ppm/C; Power: 1/10W; Populated: Yes; MCHP-ID: RSMT0382; Revision: 1; Status: Production; ComponentLink1URL: https://chn-vm-apps.microchip.com/mchprepo/parts/Datasheets/AOA0000CE2.pdf; ComponentLink1Description: Datasheet; Operating Temperature: -55C to +155C; Category: Resistor; Type: RES SMD; Composition: TKF; Supplier 1: Digi-Key; Supplier Part Number 1: P2.00KHTR-ND; Supplier 2: Digi-Key; Supplier Part Number 2: P2.00KHCT-ND; Quantity Override: 1
R55 = RES1052: Manufacturer 1: Vishay; Manufacturer Part Number 1: CRCW0603750RFKEA; Description_: RES TKF 750R 1% 1/10W SMD 0603; Dev Tools Status: Production; Voltage: 75V; Temperature Coeffcient: 100ppm/C; Power: 1/10W; Owner: Tad Ahlvers; MCHP-ID: RES1052; Revision: 1; Status: MCL Design; ComponentLink1URL: https://chn-vm-apps.microchip.com/mchprepo/parts/Datasheets/dcrcwe3.pdf; ComponentLink1Description: Datasheet; Operating Temperature: -55C to +155C; Category: Resistor; Type: RES SMD; Composition: TKF; Supplier 1: Digi-Key; Supplier Part Number 1: 541-750HCT-ND; Quantity Override: 1
R56 = RES1175: Manufacturer 1: Panasonic; Manufacturer Part Number 1: ERJ-3EKF3001V; Description_: RES TKF 3k 1% 1/10W SMD 0603; Dev Tools Status: Production; Voltage: 75V; Temperature Coeffcient: 100ppm/C; Power: 1/10W; Owner: Bogdan P (M91398); MCHP-ID: RES1175; Revision: 0; Status: MCL Design; ComponentLink1URL: https://chn-vm-apps.microchip.com/mchprepo/parts/Datasheets/AOA0000CE2.pdf; ComponentLink1Description: Datasheet; Operating Temperature: -55C to +155C; Category: Resistor; Type: RES SMD; Composition: TKF; Supplier 1: Digi-Key; Supplier Part Number 1: P3.00KHCT-ND; Quantity Override: 1
TP1-TP4 = TEST PAD TH VIA 20X10: as TP6 on sheet UNG8077_EVB_7801-9031_A_4-KSZ9031; Manufacturer: none; Category: Non BOM Item; Type: Male; Mounting Type: Through Hole; Supplier 1: none; Supplier Part Number 1: none; DNP: DNP
TP5 = TEST PAD TH VIA 20X10: Manufacturer Part Number: none; Manufacturer: none; Category: Non BOM Item; Type: Male; Mounting Type: Through Hole; Supplier 1: none; Supplier Part Number 1: none; DNP: DNP
U3 = MIC1009: LDO; Manufacturer 1: Microchip; Manufacturer Part Number 1: MCP1826ST-3302E/DB; Description_: MCHP ANALOG LDO 3.3V MCP1826S-3302E/DB SOT-223-3; MAPS Description: 1.0A LDO; Dev Tools Status: Production; Owner: Aaron VanDuerm; MPC: GEAJ1YF6XD33; PackingMedia: T/R; LeadCount: 3; TempRange: -40C to +125C; tblDeviceFamilyID: 1823; Comments: Low dropout, high current (1000 mA); SingleDual: Single; SHDN: No; VoutMin: 0.8; VoutMax: 5; OutputCurrent: 1000; Accuracy: 0.5; OutputCapType: CER/AL/TANT; RailIn: False; VOUTtyp: 0.8,1.2,1.8, 2.5,3.0, 3.3, 5.0; TypicalActiveCurrent: 120; Dropoutvoltage: 225; MinInputVoltage: 2.3; MaxInputVoltage: 6; Populated: Yes; MCHP-ID: MIC1009; Type: LDO; Status: MCL Design; Revision: 2; Category: MCHP-Analog; ComponentLink1URL: http://www.microchip.com/wwwproducts/Devices.aspx?product=MCP1826S; ComponentLink1Description: Datasheet; Manufacturer 2: Microchip; Manufacturer Part Number 2: MCP1826S-3302E/DB; Supplier 1: Microchip; Supplier Part Number 1: MCP1826ST-3302E/DB; Supplier 2: Microchip; Supplier Part Number 2: MCP1826S-3302E/DB; IntroductionDate: 2007-09-05; PackageType: SOT-223; ResetOutput: No; Adjustable: No; Brown_Out: False; Interconnect: False; Low_Batt: False; Power_Good: False; LED_Driver: False; Inductive_Boost: False; Charge_Pump: False; RailOut: False; InputChEnable: False; ProgWkUpFilter: False; WkUpPtnEnable: False; LFTalkFeture: False; EncryptAlg: False; Chamber_Test: False; Rev_Batt_Prot: False; Sens_Timer: False; Low_Bat: False; Alarm_Mem: False; WatchdogTimer: False; ManualReset: False; Quantity Override: 1
U5 = MIC6676: LDO MIC5209; Manufacturer 1: Microchip Technology                                                                               Microchip Technology; Manufacturer Part Number 1: MIC5209YM-TR; Description_: IC REG LDO ADJ 0.5A 8SOIC; MAPS Description: 500mA 1% Low Noise LDO; Dev Tools Status: Design; MPC: 218A1QEMADB2; LeadContent: Pb-FREE; PackingMedia: T/R; Stage: REL; LeadCount: 8; PackageWidth: 3.9mm; ForceMinOrderQtyMult: True; MinOrderQty: 2500; TempRange: 0C to +125C; tblDeviceFamilyID: 7408; Populated: YES; MCHP-ID: MIC6676; Symbol: MIC5209 ADJ SOIC-8; Type: Voltage Regulator; Status: MCL Design; Revision: A; Category: MCHP-Analog; ComponentLink1URL: http://www.microchip.com/wwwproducts/Devices.aspx?product=MIC5209; ComponentLink1Description: Datasheet; Supplier 1: Digi-Key; Supplier Part Number 1: MIC5209YM-TR-ND; IntroductionDate: 2015-10-18; PackageType: SOIC; Quantity Override: 1
FID1-FID6 = FIDUCIAL: Revision: 0; Description_: FIDUCIAL; DNP: DNP
MH1-MH4 = MTHOLE 4-40 120DL 220PAD: Revision: 0; Description_: MTHOLE 4-40 120DL 220PAD; DNP: DNP

## Nets that join several sheets
3V3: UNG8077_EVB_7801-9031_A_2-7801 (R5.1 R6.1), UNG8077_EVB_7801-9031_A_3-7801 (5 pins), UNG8077_EVB_7801-9031_A_4-KSZ9031 (J6.14 J6.16), UNG8077_EVB_7801-9031_A_5-Power (FB4.1 FB5.1 R21.2 R22.1)
3V3A: UNG8077_EVB_7801-9031_A_3-7801 (C9.2 U2.50), UNG8077_EVB_7801-9031_A_5-Power (C60.2 C61.2 FB5.2)
5V: UNG8077_EVB_7801-9031_A_2-7801 (C68.2 FB8.2), UNG8077_EVB_7801-9031_A_5-Power (7 pins)
AVDDH: UNG8077_EVB_7801-9031_A_4-KSZ9031 (U4.1 U4.12), UNG8077_EVB_7801-9031_A_5-Power (6 pins)
AVDDL: UNG8077_EVB_7801-9031_A_4-KSZ9031 (U4.4 U4.9 U4.44), UNG8077_EVB_7801-9031_A_5-Power (8 pins)
DVDDL: UNG8077_EVB_7801-9031_A_4-KSZ9031 (6 pins), UNG8077_EVB_7801-9031_A_5-Power (8 pins)
GND: UNG8077_EVB_7801-9031_A_2-7801 (23 pins), UNG8077_EVB_7801-9031_A_3-7801 (20 pins), UNG8077_EVB_7801-9031_A_4-KSZ9031 (20 pins), UNG8077_EVB_7801-9031_A_5-Power (52 pins)
VDD12: UNG8077_EVB_7801-9031_A_3-7801 (C15.2 FB6.2 L1.2 U2.22), UNG8077_EVB_7801-9031_A_5-Power (FB1.1 FB3.1)
VDDIO: UNG8077_EVB_7801-9031_A_2-7801 (6 pins), UNG8077_EVB_7801-9031_A_3-7801 (14 pins), UNG8077_EVB_7801-9031_A_4-KSZ9031 (10 pins), UNG8077_EVB_7801-9031_A_5-Power (7 pins)
25MHZ_REFCLK: UNG8077_EVB_7801-9031_A_2-7801 (R12.2), UNG8077_EVB_7801-9031_A_4-KSZ9031 (R31.1)
MDC_7801: UNG8077_EVB_7801-9031_A_2-7801 (U2.56), UNG8077_EVB_7801-9031_A_4-KSZ9031 (R48.2)
MDIO_7801: UNG8077_EVB_7801-9031_A_2-7801 (R50.1 U2.55), UNG8077_EVB_7801-9031_A_4-KSZ9031 (R49.2)
PHY_INT_N: UNG8077_EVB_7801-9031_A_2-7801 (U2.31), UNG8077_EVB_7801-9031_A_4-KSZ9031 (U4.38)
PHY_RESET_N: UNG8077_EVB_7801-9031_A_2-7801 (U2.32), UNG8077_EVB_7801-9031_A_4-KSZ9031 (R3.1)
RX_CTL: UNG8077_EVB_7801-9031_A_2-7801 (U2.13), UNG8077_EVB_7801-9031_A_4-KSZ9031 (R27.2)
RXC: UNG8077_EVB_7801-9031_A_2-7801 (U2.12), UNG8077_EVB_7801-9031_A_4-KSZ9031 (R28.2)
RXD0: UNG8077_EVB_7801-9031_A_2-7801 (U2.14), UNG8077_EVB_7801-9031_A_4-KSZ9031 (R26.2)
RXD1: UNG8077_EVB_7801-9031_A_2-7801 (U2.15), UNG8077_EVB_7801-9031_A_4-KSZ9031 (R25.2)
RXD2: UNG8077_EVB_7801-9031_A_2-7801 (U2.16), UNG8077_EVB_7801-9031_A_4-KSZ9031 (R24.2)
RXD3: UNG8077_EVB_7801-9031_A_2-7801 (U2.17), UNG8077_EVB_7801-9031_A_4-KSZ9031 (R23.2)
SW_RESET: UNG8077_EVB_7801-9031_A_2-7801 (J4.2), UNG8077_EVB_7801-9031_A_4-KSZ9031 (R4.1)
TX_CTL: UNG8077_EVB_7801-9031_A_2-7801 (R16.2), UNG8077_EVB_7801-9031_A_4-KSZ9031 (U4.25)
TXC: UNG8077_EVB_7801-9031_A_2-7801 (R15.2), UNG8077_EVB_7801-9031_A_4-KSZ9031 (U4.24)
TXD0: UNG8077_EVB_7801-9031_A_2-7801 (R17.2), UNG8077_EVB_7801-9031_A_4-KSZ9031 (U4.19)
TXD1: UNG8077_EVB_7801-9031_A_2-7801 (R18.2), UNG8077_EVB_7801-9031_A_4-KSZ9031 (U4.20)
TXD2: UNG8077_EVB_7801-9031_A_2-7801 (R19.2), UNG8077_EVB_7801-9031_A_4-KSZ9031 (U4.21)
TXD3: UNG8077_EVB_7801-9031_A_2-7801 (R20.2), UNG8077_EVB_7801-9031_A_4-KSZ9031 (U4.22)